# EAGLE schematic power_supply_unit (EAGLE 7.6.0)
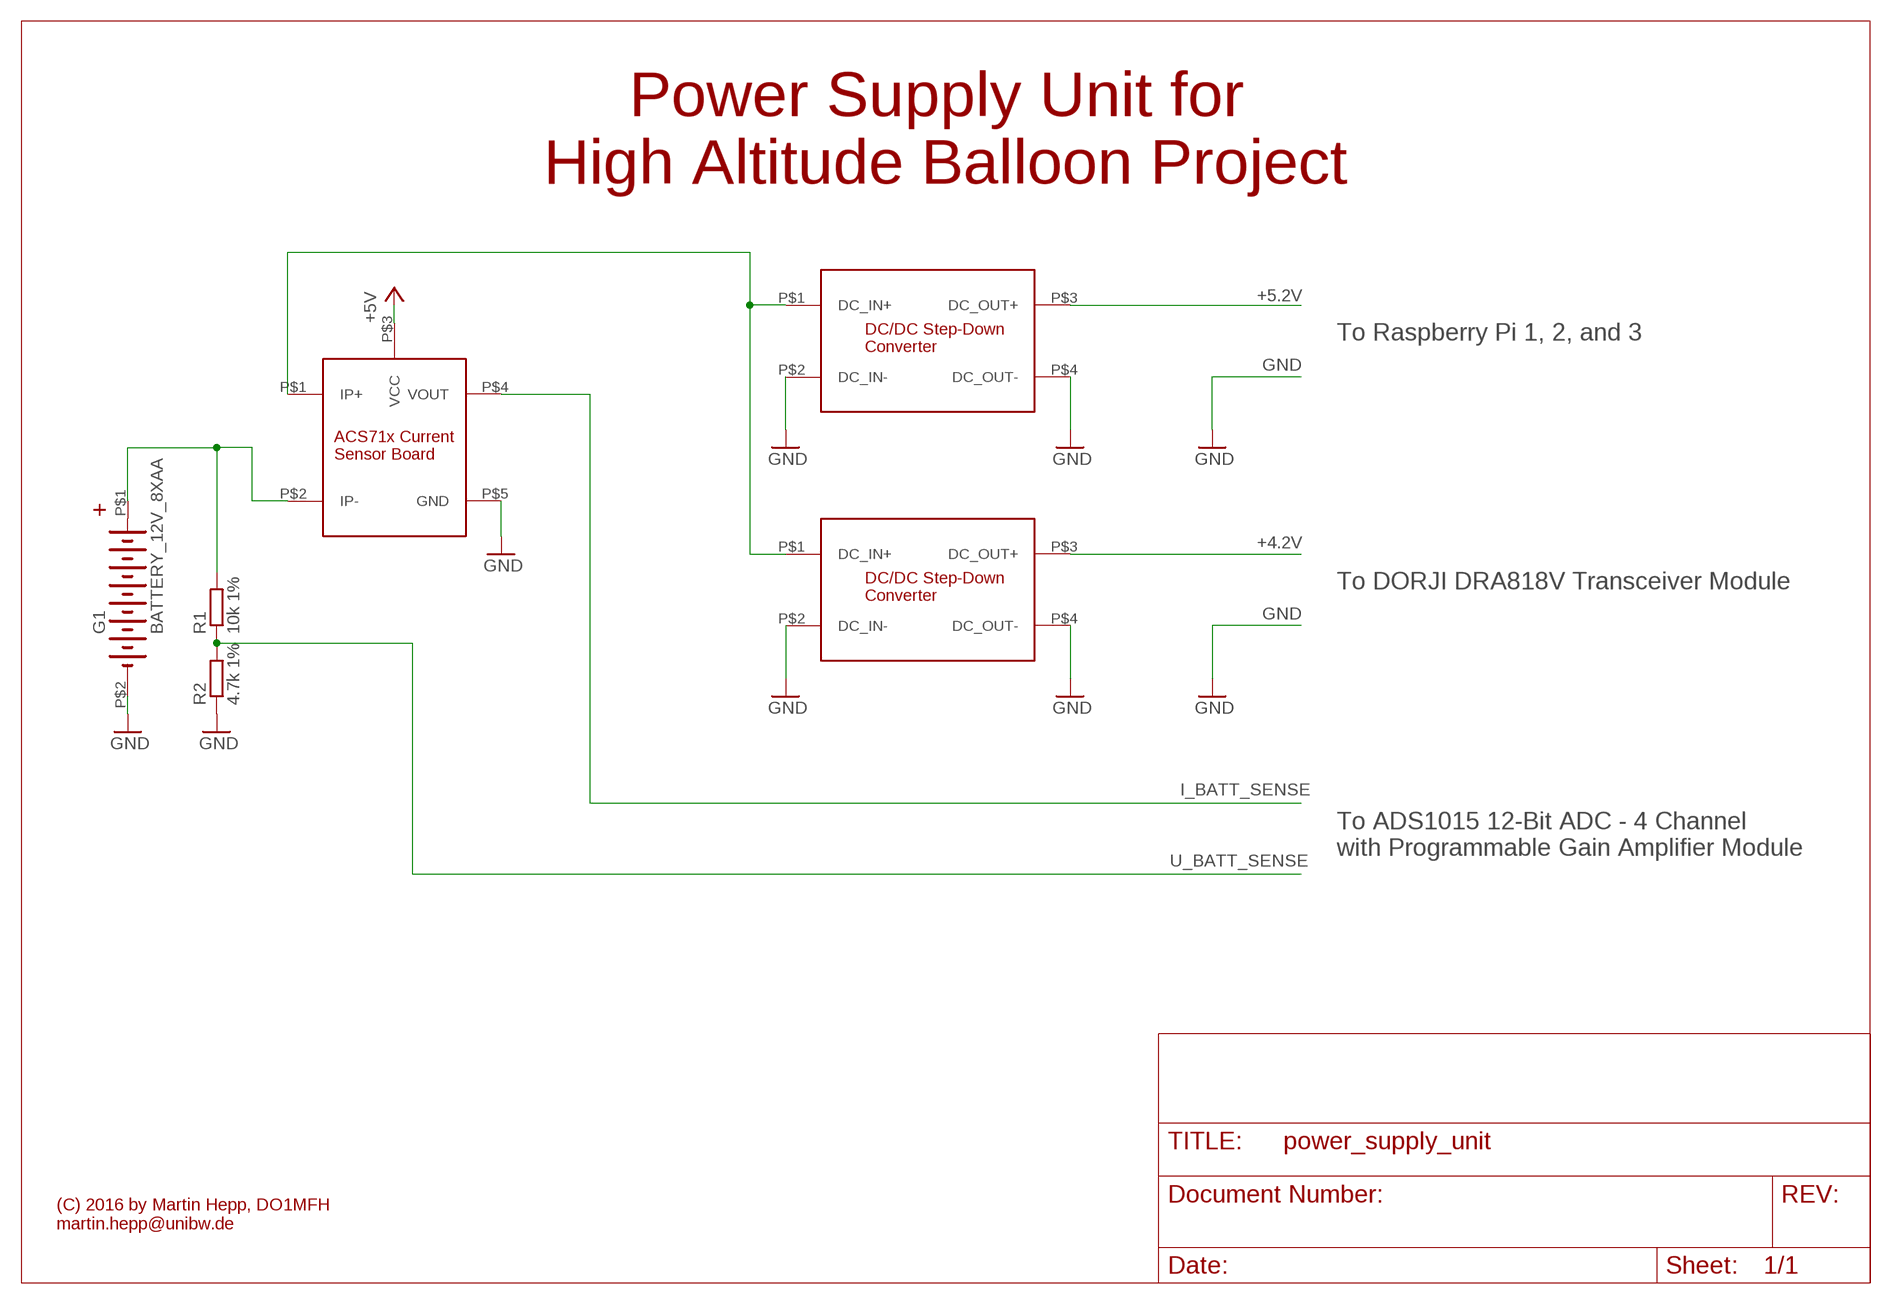
[diagram p0: schematic, sheet 1]

## Parts
G1  BATTERY_12V_8XAA  [BATTERY_12V_8XAA]
R1  10k 1%  R-EU_0207/10  [0207/10]
R2  4.7k 1%  R-EU_0207/10  [0207/10]
U$1  STEP_DOWN_CONVERTER  [DUMMY_PACKAGE]
U$2  STEP_DOWN_CONVERTER  [DUMMY_PACKAGE]
U$3  ACS71X_CURRENT_SENSOR  [DUMMY_PACKAGE2]

## Nets
+5V: U$3.P$3(VCC)
GND: G1.P$2(-) R2.1 U$3.P$5(GND)
I_BATT_SENSE: U$3.P$4(VOUT)
N$1: G1.P$1(+) R1.2 U$3.P$2(IP-)
N$2: U$3.P$1(IP+)
U_BATT_SENSE: R1.1 R2.2
Unconnected: U$1.P$1(DC_IN+) U$1.P$2(DC_IN-) U$1.P$3(DC_OUT+) U$1.P$4(DC_OUT-) U$2.P$1(DC_IN+) U$2.P$2(DC_IN-) U$2.P$3(DC_OUT+) U$2.P$4(DC_OUT-)

## Notes on the sheet
- Power Supply Unit for 
  High Altitude Balloon Project
- To Raspberry Pi 1, 2, and 3
- To DORJI DRA818V Transceiver Module
- To ADS1015 12-Bit ADC - 4 Channel 
  with Programmable Gain Amplifier Module
- (C) 2016 by Martin Hepp, DO1MFH
  martin.hepp@unibw.de

## Library data of the parts
G1 = martins-parts:BATTERY_12V_8XAA: NC ACCU Varta Safe Tronic 4V8
R1 R2 = resistor:R-EU_: RESISTOR, European symbol
U$1 U$2 = martins-parts:STEP_DOWN_CONVERTER
U$3 = martins-parts:ACS71X_CURRENT_SENSOR